# Altium schematic sheet RF_Modules_3D.SchDoc
size A4; Author: JMO; Address1: ETML-ES; Address2: Rue Sébeillon 12; Address3: 1004 Lausanne; Revision: 1730C; SheetNumber: 5; SheetTotal: 5; Version: C; Modifa: Schéma initial pour version C
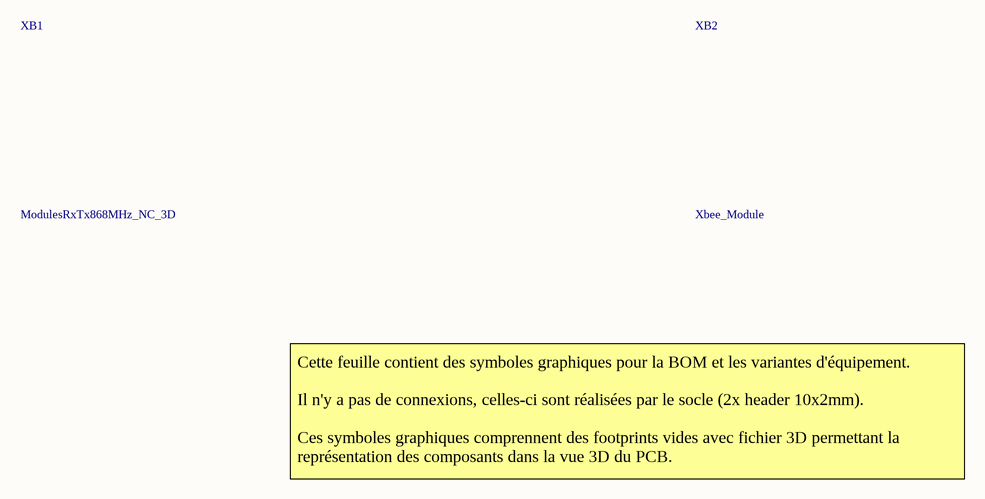
[diagram p0: RF_Modules_3D.SchDoc]

## Parts
XB1  ModulesRxTx868MHz_NC_3D  [ModulesRxTx868MHz_1623]
XB2  Xbee_Module  [Xbee_3D]

## Notes on the sheet
- Cette feuille contient des symboles graphiques pour la BOM et les variantes d'équipement.
  Il n'y a pas de connexions, celles-ci sont réalisées par le socle (2x header 10x2mm).
  Ces symboles graphiques comprennent des footprints vides avec fichier 3D permettant la représentation des composants dans la vue 3D du PCB.
- Fichier :
- a
- Date :
- Heure :
- Version :
- Auteur :
- Modif.
- b
- c
- d
- Projet :
- No :
- Nb feuilles
- Feuille n°
- Chemin :

## Library data of the parts
XB1 = ModulesRxTx868MHz_Empty: 2x Header 2x10 2mm / compatible xBee - sans connexion, avec footprint; PackageCase: XBee; Value: 2x10; Supplier: Digi-key; Supplier PN: 2x 3M156413-10-ND; Supplier min. qty: 1; Supplier unit price: 2x 0.74
XB2 = Xbee_Module: Module Xbee 3D pour BOM et représentation 3D